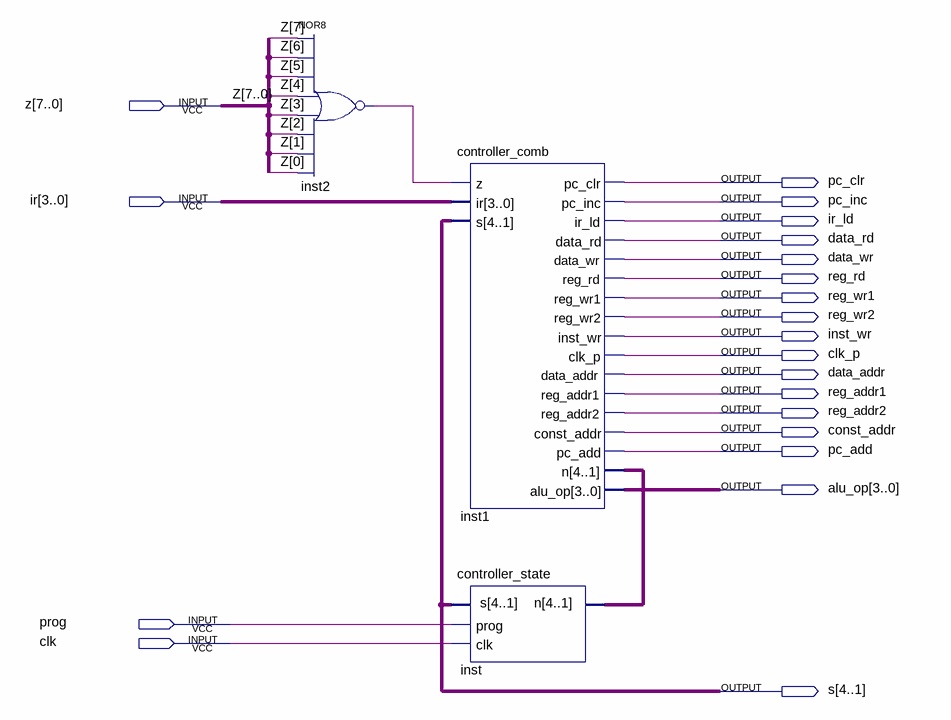
[diagram p0: schematic sheet]
// Quartus schematic controller.bdf as structural Verilog: 3 symbols, 21 pins
module controller (
  input  [7:0] z,
  input  [3:0] ir,
  input  prog,
  input  clk,
  output pc_clr,
  output pc_inc,
  output ir_ld,
  output data_rd,
  output data_wr,
  output reg_rd,
  output reg_wr1,
  output reg_wr2,
  output inst_wr,
  output clk_p,
  output data_addr,
  output reg_addr1,
  output reg_addr2,
  output const_addr,
  output pc_add,
  output [3:0] alu_op,
  output [4:1] s
);

  wire inst2_out;
  wire [3:0] inst1_n;

  nor inst2 (inst2_out, z[7], z[6], z[5], z[4], z[3], z[2], z[1], z[0]);
  controller_comb inst1 (
    .z(inst2_out), .ir(ir), .s(s), .pc_clr(pc_clr), .pc_inc(pc_inc), .ir_ld(ir_ld), .data_rd(data_rd),
    .data_wr(data_wr), .reg_rd(reg_rd), .reg_wr1(reg_wr1), .reg_wr2(reg_wr2), .inst_wr(inst_wr),
    .clk_p(clk_p), .data_addr(data_addr), .reg_addr1(reg_addr1), .reg_addr2(reg_addr2),
    .const_addr(const_addr), .pc_add(pc_add), .n(inst1_n), .alu_op(alu_op));
  controller_state inst (.n(inst1_n), .prog(prog), .clk(clk), .s(s));
endmodule
